# Altium schematic sheet STM32G4.SchDoc
size A4
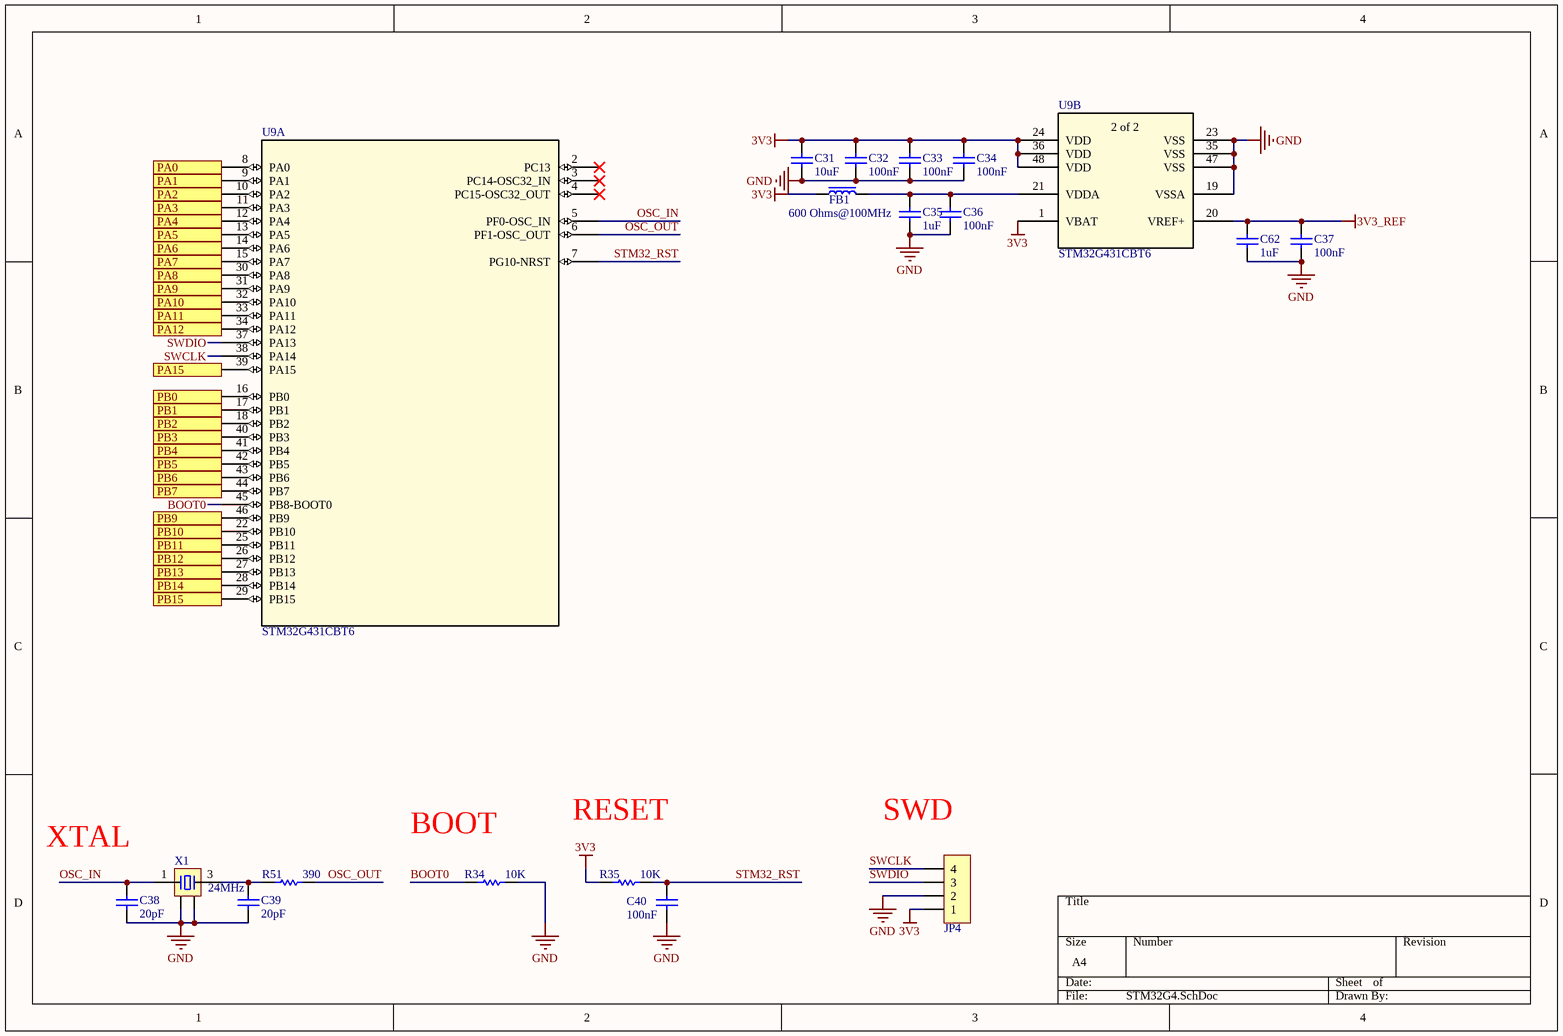
[diagram p0: STM32G4.SchDoc]

## Parts
C31  10uF  [C0805]
C32  100nF  [C0402]
C33  100nF  [C0402]
C34  100nF  [C0402]
C35  1uF  [C0603]
C36  100nF  [C0402]
C37  100nF  [C0402]
C38  20pF  [C0402]
C39  20pF  [C0402]
C40  100nF  [C0402]
C62  1uF  [C0603]
FB1  600 Ohms@100MHz  [FB 0402]
JP4  HDR-1X4  [XH2.54-4P_H]  (value not drawn)
R34  10K  [R0402]
R35  10K  [R0402]
R51  390  [R0402]
U9  STM32G431CBT6  [LQFP48 7X7_L]  (parts A,B of 2)
X1  24MHz  [XTAL-3225]

## Ports
PA0, PA1, PA2, PA3, PA4, PA5, PA6, PA7, PA8, PA9, PA10, PA11, PA12, PA15, PB0, PB1, PB2, PB3, PB4, PB5, PB6, PB7, PB9, PB10, PB11, PB12, PB13, PB14, PB15

## Nets
3V3: C31.2 C32.2 C33.2 C34.2 FB1.1 JP4.1 R35.1 U9.1(VBAT) U9.24(VDD) U9.36(VDD) U9.48(VDD)
3V3_REF: C37.1 C62.1 U9.20(VREF+)
GND: C31.1 C32.1 C33.1 C34.1 C35.2 C36.2 C37.2 C38.1 C39.1 C40.1 C62.2 JP4.2 R34.2 U9.19(VSSA) U9.23(VSS) U9.35(VSS) U9.47(VSS) X1.2 X1.4
BOOT0: R34.1 U9.45(PB8-BOOT0)
OSC_IN: C38.2 U9.5(PF0-OSC_IN) X1.1
OSC_OUT: R51.2 U9.6(PF1-OSC_OUT)
PA0: U9.8(PA0) ; port PA0
PA1: U9.9(PA1) ; port PA1
PA2: U9.10(PA2) ; port PA2
PA3: U9.11(PA3) ; port PA3
PA4: U9.12(PA4) ; port PA4
PA5: U9.13(PA5) ; port PA5
PA6: U9.14(PA6) ; port PA6
PA7: U9.15(PA7) ; port PA7
PA8: U9.30(PA8) ; port PA8
PA9: U9.31(PA9) ; port PA9
PA10: U9.32(PA10) ; port PA10
PA11: U9.33(PA11) ; port PA11
PA12: U9.34(PA12) ; port PA12
PA15: U9.39(PA15) ; port PA15
PB0: U9.16(PB0) ; port PB0
PB1: U9.17(PB1) ; port PB1
PB2: U9.18(PB2) ; port PB2
PB3: U9.40(PB3) ; port PB3
PB4: U9.41(PB4) ; port PB4
PB5: U9.42(PB5) ; port PB5
PB6: U9.43(PB6) ; port PB6
PB7: U9.44(PB7) ; port PB7
PB9: U9.46(PB9) ; port PB9
PB10: U9.22(PB10) ; port PB10
PB11: U9.25(PB11) ; port PB11
PB12: U9.26(PB12) ; port PB12
PB13: U9.27(PB13) ; port PB13
PB14: U9.28(PB14) ; port PB14
PB15: U9.29(PB15) ; port PB15
STM32_RST: C40.2 R35.2 U9.7(PG10-NRST)
SWCLK: JP4.4 U9.38(PA14)
SWDIO: JP4.3 U9.37(PA13)
NetC35_1: C35.1 C36.1 FB1.2 U9.21(VDDA)
NetC39_2: C39.2 R51.1 X1.3

Not connected (* = marked no-connect by the designer): U9 2(PC13)* 3(PC14-OSC32_IN)* 4(PC15-OSC32_OUT)*

## Notes on the sheet
- (near C38) XTAL
- (near R34) BOOT
- RESET
- (near JP4) SWD
- (in symbol STM32G431CBT6, part B) 2 of 2

## Library data of the parts
C31-C40 C62 = Cap
FB1 = FB: 磁珠
JP4 = Header 4P: 4P接插件; 版权归属: 源创客; BOM名称: 4P接插件; 学习资源: www.ooocke.com
R34 R35 R51 = RES
U9 = STM32G431CBT6: No Description Available; Mfr_Name: STMicroelectronics; Copyright: Copyright (C) 2022 Ultra Librarian. All rights reserved.; Manufacturer_Part_Number: STM32G431CBT6; RefDes: RefDes; Type: DEV
X1 = XTAL-4: 4脚晶振; 版权归属: 源创客; BOM名称: 4脚晶振; 学习资源: www.ooocke.com